# Altium project RK3399-core.PrjPcb
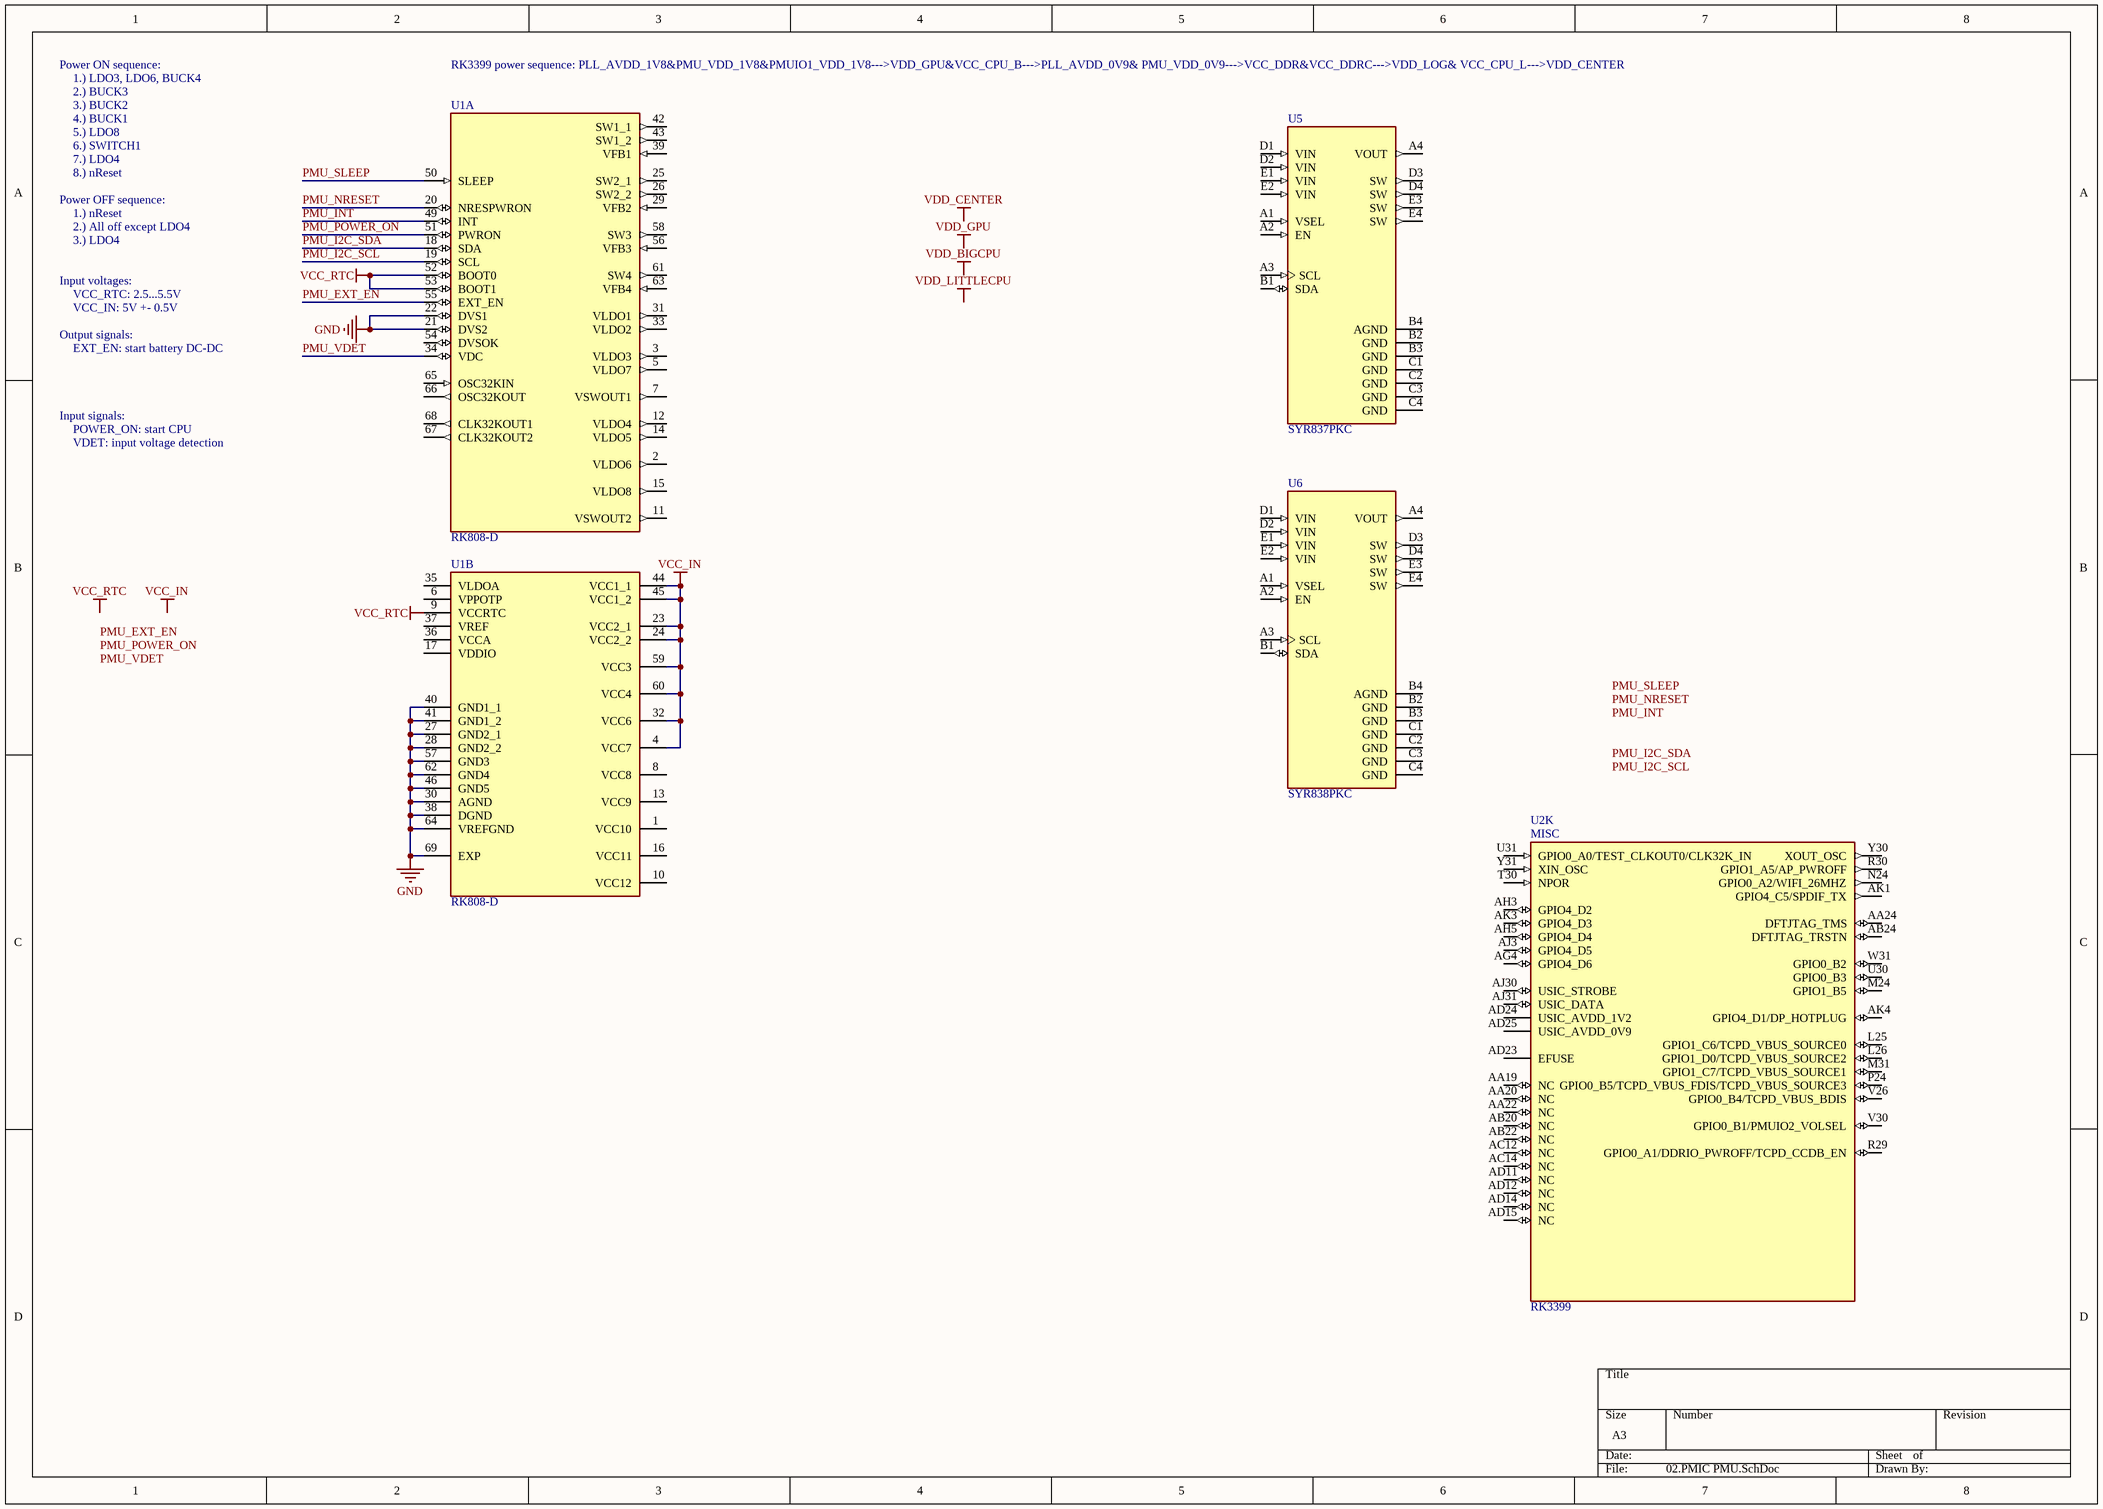
[diagram p0: 02.PMIC PMU.SchDoc]
10 sheets, 6 parts. Net scope: global (net labels, ports and power ports of the same name join across sheets).
Board file: RK3399-core.PcbDoc
Sheets:
  01.Notes.SchDoc
  02.PMIC PMU.SchDoc
  03.RK3399 Power.SchDoc
  04.RK3399 DDR Controller.SchDoc
  05.RK3399 Storage.SchDoc
  06.RK3399 USB.SchDoc
  07.RK3399 Display.SchDoc
  08.RK3399 High speed.SchDoc
  09.RK3399 Misc.SchDoc
  10.LPDDR4.SchDoc

## Sheet 01.Notes.SchDoc
size A4; SheetNumber: 1; SheetTotal: 10

## Sheet 02.PMIC PMU.SchDoc
size A3; SheetNumber: 2; SheetTotal: 10

### Parts
U1  RK808-D  [QFN35P700X700X80-69N]  (parts A,B of 2)
U2  RK3399  [BGA828C65P31X31_2100X2100X161N]  (part K of 32)
U5  SYR837PKC  [BGA20N40P5X4_196X156X66N]
U6  SYR838PKC  [BGA20N40P5X4_196X156X66N]

### Nets
GND: U1.21(DVS2) U1.22(DVS1) U1.27(GND2_1) U1.28(GND2_2) U1.30(AGND) U1.38(DGND) U1.40(GND1_1) U1.41(GND1_2) U1.46(GND5) U1.57(GND3) U1.62(GND4) U1.64(VREFGND) U1.69(EXP)
VCC_IN: U1.4(VCC7) U1.23(VCC2_1) U1.24(VCC2_2) U1.32(VCC6) U1.44(VCC1_1) U1.45(VCC1_2) U1.59(VCC3) U1.60(VCC4)
VCC_RTC: U1.9(VCCRTC) U1.52(BOOT0) U1.53(BOOT1)
PMU_EXT_EN: U1.55(EXT_EN)
PMU_I2C_SCL: U1.19(SCL)
PMU_I2C_SDA: U1.18(SDA)
PMU_INT: U1.49(INT)
PMU_NRESET: U1.20(NRESPWRON)
PMU_POWER_ON: U1.51(PWRON)
PMU_SLEEP: U1.50(SLEEP)
PMU_VDET: U1.34(VDC)

Not connected (* = marked no-connect by the designer): U1 1(VCC10) 2(VLDO6) 3(VLDO3) 5(VLDO7) 6(VPPOTP) 7(VSWOUT1) 8(VCC8) 10(VCC12) 11(VSWOUT2) 12(VLDO4) 13(VCC9) 14(VLDO5) 15(VLDO8) 16(VCC11) 17(VDDIO) 25(SW2_1) 26(SW2_2) 29(VFB2) 31(VLDO1) 33(VLDO2) 35(VLDOA) 36(VCCA) 37(VREF) 39(VFB1) 42(SW1_1) 43(SW1_2) 54(DVSOK) 56(VFB3) 58(SW3) 61(SW4) 63(VFB4) 65(OSC32KIN) 66(OSC32KOUT) 67(CLK32KOUT2) 68(CLK32KOUT1); U2 AA19(NC) AA20(NC) AA22(NC) AA24(DFTJTAG_TMS) AB20(NC) AB22(NC) AB24(DFTJTAG_TRSTN) AC12(NC) AC14(NC) AD11(NC) AD12(NC) AD14(NC) AD15(NC) AD23(EFUSE) AD24(USIC_AVDD_1V2) AD25(USIC_AVDD_0V9) AG4(GPIO4_D6) AH3(GPIO4_D2) AH5(GPIO4_D4) AJ3(GPIO4_D5) AJ30(USIC_STROBE) AJ31(USIC_DATA) AK1(GPIO4_C5/SPDIF_TX) AK3(GPIO4_D3) AK4(GPIO4_D1/DP_HOTPLUG) L25(GPIO1_C6/TCPD_VBUS_SOURCE0) L26(GPIO1_D0/TCPD_VBUS_SOURCE2) M24(GPIO1_B5) M31(GPIO1_C7/TCPD_VBUS_SOURCE1) N24(GPIO0_A2/WIFI_26MHZ) P24(GPIO0_B5/TCPD_VBUS_FDIS/TCPD_VBUS_SOURCE3) R29(GPIO0_A1/DDRIO_PWROFF/TCPD_CCDB_EN) R30(GPIO1_A5/AP_PWROFF) T30(NPOR) U30(GPIO0_B3) U31(GPIO0_A0/TEST_CLKOUT0/CLK32K_IN) V26(GPIO0_B4/TCPD_VBUS_BDIS) V30(GPIO0_B1/PMUIO2_VOLSEL) W31(GPIO0_B2) Y30(XOUT_OSC) Y31(XIN_OSC); U5 A1(VSEL) A2(EN) A3(SCL) A4(VOUT) B1(SDA) B2(GND) B3(GND) B4(AGND) C1(GND) C2(GND) C3(GND) C4(GND) D1(VIN) D2(VIN) D3(SW) D4(SW) E1(VIN) E2(VIN) E3(SW) E4(SW); U6 A1(VSEL) A2(EN) A3(SCL) A4(VOUT) B1(SDA) B2(GND) B3(GND) B4(AGND) C1(GND) C2(GND) C3(GND) C4(GND) D1(VIN) D2(VIN) D3(SW) D4(SW) E1(VIN) E2(VIN) E3(SW) E4(SW)

### Notes on the sheet
- Power ON sequence:
- 1.) LDO3, LDO6, BUCK4
- 2.) BUCK3
- 3.) BUCK2
- RK3399 power sequence: PLL_AVDD_1V8&PMU_VDD_1V8&PMUIO1_VDD_1V8--->VDD_GPU&VCC_CPU_B--->PLL_AVDD_0V9& PMU_VDD_0V9--->VCC_DDR&VCC_DDRC--->VDD_LOG& VCC_CPU_L--->VDD_CENTER
- 4.) BUCK1
- 5.) LDO8
- 6.) SWITCH1
- 7.) LDO4
- 8.) nReset
- Power OFF sequence:
- 1.) nReset
- 2.) All off except LDO4
- 3.) LDO4
- Input voltages:
- VCC_RTC: 2.5...5.5V
- VCC_IN: 5V +- 0.5V
- Output signals:
- EXT_EN: start battery DC-DC
- Input signals:
- POWER_ON: start CPU
- VDET: input voltage detection
- Labels drawn without touching a wire or pin: PMU_EXT_EN, PMU_I2C_SCL, PMU_I2C_SDA, PMU_INT, PMU_NRESET, PMU_POWER_ON, PMU_SLEEP, PMU_VDET, VCC_IN, VCC_RTC, VDD_BIGCPU, VDD_CENTER, VDD_GPU, VDD_LITTLECPU
- (in symbol RK3399, part K) MISC

### Library data of the parts
U1 = RK808-D: Power Management System; MF: Fuzhou Rockchip Electronics Co; Value: *; SnapEDA_Link: https://www.snapeda.com/parts/RK808-D/Fuzhou%20Rockchip%20Electronics%20Co/view-part/1600581/?ref=snap; Price: None; Availability: Unavailable; Package: None; MP: RK808-D
U2 = RK3399: RK3399 ROCK Pi 4 Model A 2GB - ARMÂ® CortexÂ®-A53, CortexÂ®-A72 MPU Embedded Evaluation Board; MF: Rockchip; SnapEDA_Link: https://www.snapeda.com/parts/RK3399/Fuzhou+Rockchip+Electronics+Co/view-part/?ref=snap; Package: Seeed Technology; MP: RK3399; Check_prices: https://www.snapeda.com/parts/RK3399/Fuzhou+Rockchip+Electronics+Co/view-part/?ref=eda; Price: None; Value: *; Availability: Not in stock
U5 U6 = SYR837PKC: SYR837/SYR838 is a high efficiency 2.4MHz synchronous step down DC/DC regulator IC capable of delivering up to 6A output currents.; MF: Silergy; SnapEDA_Link: https://www.snapeda.com/parts/SYR837PKC/Silergy/view-part/2756982/?ref=snap; Value: *; MP: SYR837PKC; Package: None; Price: None; Availability: Unavailable

## Sheet 03.RK3399 Power.SchDoc
size A3; SheetNumber: 3; SheetTotal: 10
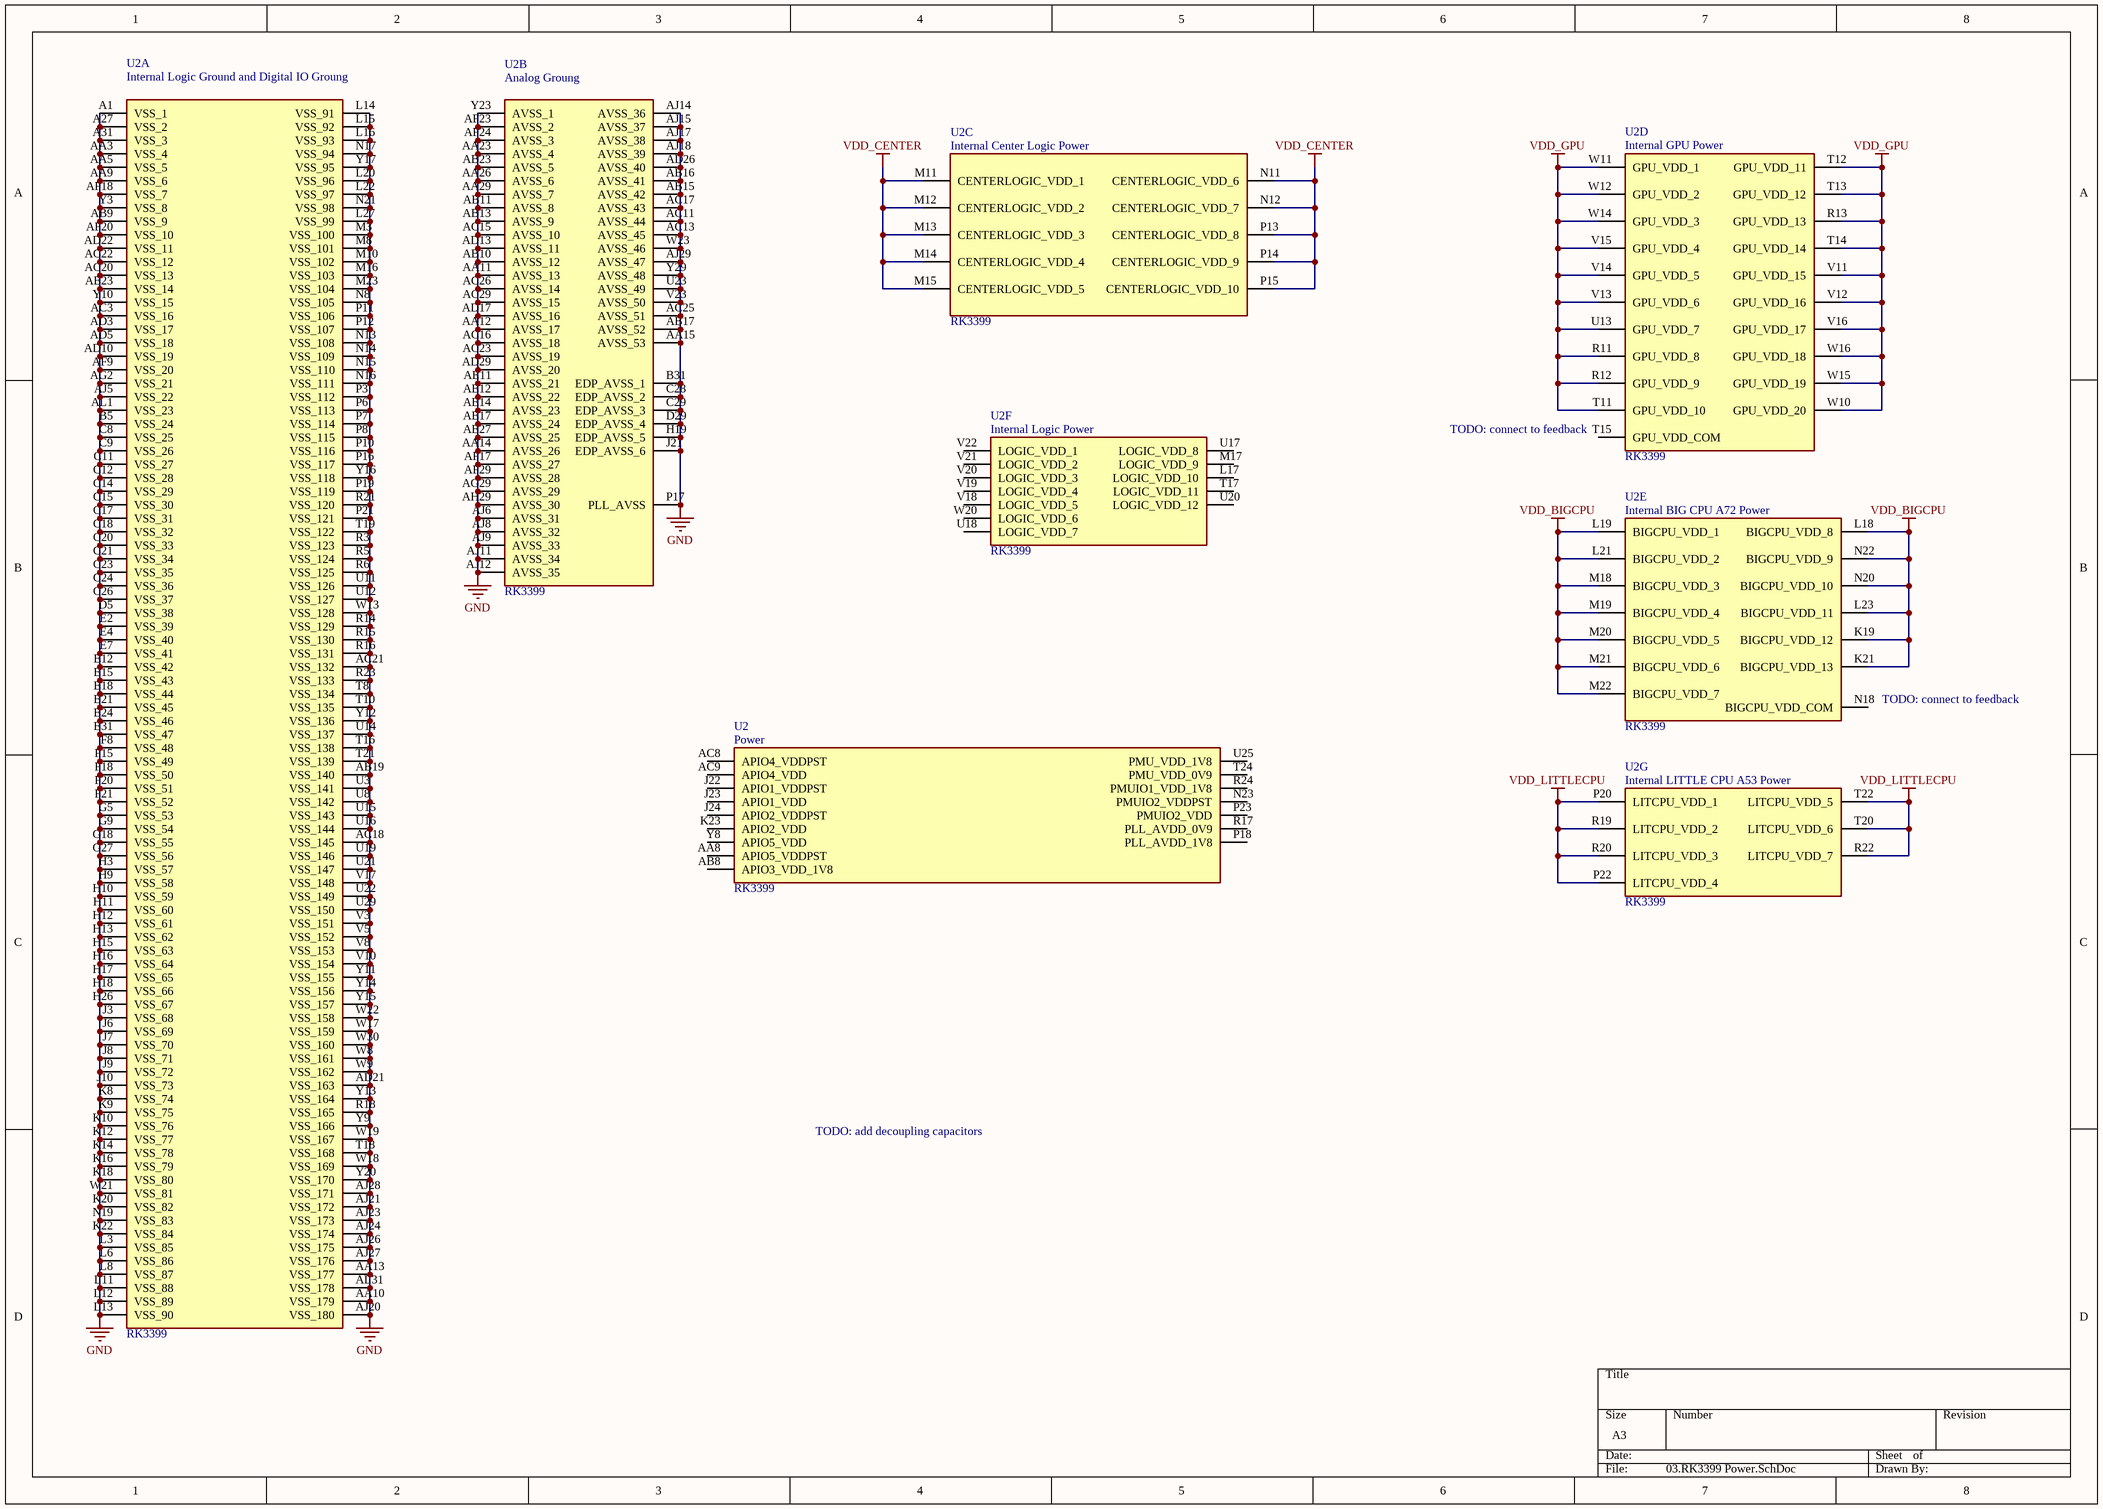
[diagram p1: 03.RK3399 Power.SchDoc]

### Parts
U2  RK3399  [BGA828C65P31X31_2100X2100X161N]  (parts A,B,C,D,E,F,G,29 of 32)

### Nets
GND: U2.A1(VSS_1) U2.A27(VSS_2) U2.A31(VSS_3) U2.AA3(VSS_4) U2.AA5(VSS_5) U2.AA9(VSS_6) U2.AA10(VSS_179) U2.AA11(AVSS_13) U2.AA12(AVSS_17) U2.AA13(VSS_177) U2.AA14(AVSS_26) U2.AA15(AVSS_53) U2.AA23(AVSS_4) U2.AA26(AVSS_6) U2.AA29(AVSS_7) U2.AB9(VSS_9) U2.AB10(AVSS_12) U2.AB11(AVSS_8) U2.AB13(AVSS_9) U2.AB15(AVSS_42) U2.AB16(AVSS_41) U2.AB17(AVSS_52) U2.AB19(VSS_140) U2.AB23(AVSS_5) U2.AC3(VSS_16) U2.AC11(AVSS_44) U2.AC13(AVSS_45) U2.AC15(AVSS_10) U2.AC16(AVSS_18) U2.AC17(AVSS_43) U2.AC18(VSS_145) U2.AC20(VSS_13) U2.AC21(VSS_132) U2.AC22(VSS_12) U2.AC23(AVSS_19) U2.AC25(AVSS_51) U2.AC26(AVSS_14) U2.AC29(AVSS_15) U2.AD3(VSS_17) U2.AD5(VSS_18) U2.AD10(VSS_19) U2.AD13(AVSS_11) U2.AD17(AVSS_16) U2.AD21(VSS_163) U2.AD22(VSS_11) U2.AD26(AVSS_40) U2.AD29(AVSS_20) U2.AE11(AVSS_21) U2.AE12(AVSS_22) U2.AE14(AVSS_23) U2.AE17(AVSS_24) U2.AE23(VSS_14) U2.AE27(AVSS_25) U2.AF9(VSS_20) U2.AF17(AVSS_27) U2.AF18(VSS_7) U2.AF20(VSS_10) U2.AF23(AVSS_2) U2.AF24(AVSS_3) U2.AF29(AVSS_28) U2.AG2(VSS_21) U2.AG29(AVSS_29) U2.AH29(AVSS_30) U2.AJ5(VSS_22) U2.AJ6(AVSS_31) U2.AJ8(AVSS_32) U2.AJ9(AVSS_33) U2.AJ11(AVSS_34) U2.AJ12(AVSS_35) U2.AJ14(AVSS_36) U2.AJ15(AVSS_37) U2.AJ17(AVSS_38) U2.AJ18(AVSS_39) U2.AJ20(VSS_180) U2.AJ21(VSS_172) U2.AJ23(VSS_173) U2.AJ24(VSS_174) U2.AJ26(VSS_175) U2.AJ27(VSS_176) U2.AJ28(VSS_171) U2.AJ29(AVSS_47) U2.AL1(VSS_23) U2.AL31(VSS_178) U2.B5(VSS_24) U2.B31(EDP_AVSS_1) U2.C8(VSS_25) U2.C9(VSS_26) U2.C11(VSS_27) U2.C12(VSS_28) U2.C14(VSS_29) U2.C15(VSS_30) U2.C17(VSS_31) U2.C18(VSS_32) U2.C20(VSS_33) U2.C21(VSS_34) U2.C23(VSS_35) U2.C24(VSS_36) U2.C26(VSS_37) U2.C28(EDP_AVSS_2) U2.C29(EDP_AVSS_3) U2.D5(VSS_38) U2.D29(EDP_AVSS_4) U2.E2(VSS_39) U2.E4(VSS_40) U2.E7(VSS_41) U2.E12(VSS_42) U2.E15(VSS_43) U2.E18(VSS_44) U2.E21(VSS_45) U2.E24(VSS_46) U2.E31(VSS_47) U2.F8(VSS_48) U2.F15(VSS_49) U2.F18(VSS_50) U2.F20(VSS_51) U2.F21(VSS_52) U2.G5(VSS_53) U2.G9(VSS_54) U2.G18(VSS_55) U2.G27(VSS_56) U2.H3(VSS_57) U2.H9(VSS_58) U2.H10(VSS_59) U2.H11(VSS_60) U2.H12(VSS_61) U2.H13(VSS_62) U2.H15(VSS_63) U2.H16(VSS_64) U2.H17(VSS_65) U2.H18(VSS_66) U2.H19(EDP_AVSS_5) U2.H26(VSS_67) U2.J3(VSS_68) U2.J6(VSS_69) U2.J7(VSS_70) U2.J8(VSS_71) U2.J9(VSS_72) U2.J10(VSS_73) U2.J21(EDP_AVSS_6) U2.K8(VSS_74) U2.K9(VSS_75) U2.K10(VSS_76) U2.K12(VSS_77) U2.K14(VSS_78) U2.K16(VSS_79) U2.K18(VSS_80) U2.K20(VSS_82) U2.K22(VSS_84) U2.L3(VSS_85) U2.L6(VSS_86) U2.L8(VSS_87) U2.L11(VSS_88) U2.L12(VSS_89) U2.L13(VSS_90) U2.L14(VSS_91) U2.L15(VSS_92) U2.L16(VSS_93) U2.L20(VSS_96) U2.L22(VSS_97) U2.L27(VSS_99) U2.M3(VSS_100) U2.M8(VSS_101) U2.M10(VSS_102) U2.M16(VSS_103) U2.M23(VSS_104) U2.N8(VSS_105) U2.N13(VSS_108) U2.N14(VSS_109) U2.N15(VSS_110) U2.N16(VSS_111) U2.N17(VSS_94) U2.N19(VSS_83) U2.N21(VSS_98) U2.P3(VSS_112) U2.P6(VSS_113) U2.P7(VSS_114) U2.P8(VSS_115) U2.P10(VSS_116) U2.P11(VSS_106) U2.P12(VSS_107) U2.P16(VSS_117) U2.P17(PLL_AVSS) U2.P19(VSS_119) U2.P21(VSS_121) U2.R3(VSS_123) U2.R5(VSS_124) U2.R6(VSS_125) U2.R14(VSS_129) U2.R15(VSS_130) U2.R16(VSS_131) U2.R18(VSS_165) U2.R21(VSS_120) U2.R23(VSS_133) U2.T8(VSS_134) U2.T10(VSS_135) U2.T16(VSS_138) U2.T18(VSS_168) U2.T19(VSS_122) U2.T21(VSS_139) U2.U3(VSS_141) U2.U8(VSS_142) U2.U11(VSS_126) U2.U12(VSS_127) U2.U14(VSS_137) U2.U15(VSS_143) U2.U16(VSS_144) U2.U19(VSS_146) U2.U21(VSS_147) U2.U22(VSS_149) U2.U23(AVSS_49) U2.U29(VSS_150) U2.V3(VSS_151) U2.V5(VSS_152) U2.V8(VSS_153) U2.V10(VSS_154) U2.V17(VSS_148) U2.V23(AVSS_50) U2.W8(VSS_161) U2.W9(VSS_162) U2.W13(VSS_128) U2.W17(VSS_159) U2.W18(VSS_169) U2.W19(VSS_167) U2.W21(VSS_81) U2.W22(VSS_158) U2.W23(AVSS_46) U2.W30(VSS_160) U2.Y3(VSS_8) U2.Y9(VSS_166) U2.Y10(VSS_15) U2.Y11(VSS_155) U2.Y12(VSS_136) U2.Y13(VSS_164) U2.Y14(VSS_156) U2.Y15(VSS_157) U2.Y16(VSS_118) U2.Y17(VSS_95) U2.Y20(VSS_170) U2.Y23(AVSS_1) U2.Y29(AVSS_48)
VDD_BIGCPU: U2.K19(BIGCPU_VDD_12) U2.K21(BIGCPU_VDD_13) U2.L18(BIGCPU_VDD_8) U2.L19(BIGCPU_VDD_1) U2.L21(BIGCPU_VDD_2) U2.L23(BIGCPU_VDD_11) U2.M18(BIGCPU_VDD_3) U2.M19(BIGCPU_VDD_4) U2.M20(BIGCPU_VDD_5) U2.M21(BIGCPU_VDD_6) U2.M22(BIGCPU_VDD_7) U2.N20(BIGCPU_VDD_10) U2.N22(BIGCPU_VDD_9)
VDD_CENTER: U2.M11(CENTERLOGIC_VDD_1) U2.M12(CENTERLOGIC_VDD_2) U2.M13(CENTERLOGIC_VDD_3) U2.M14(CENTERLOGIC_VDD_4) U2.M15(CENTERLOGIC_VDD_5) U2.N11(CENTERLOGIC_VDD_6) U2.N12(CENTERLOGIC_VDD_7) U2.P13(CENTERLOGIC_VDD_8) U2.P14(CENTERLOGIC_VDD_9) U2.P15(CENTERLOGIC_VDD_10)
VDD_GPU: U2.R11(GPU_VDD_8) U2.R12(GPU_VDD_9) U2.R13(GPU_VDD_13) U2.T11(GPU_VDD_10) U2.T12(GPU_VDD_11) U2.T13(GPU_VDD_12) U2.T14(GPU_VDD_14) U2.U13(GPU_VDD_7) U2.V11(GPU_VDD_15) U2.V12(GPU_VDD_16) U2.V13(GPU_VDD_6) U2.V14(GPU_VDD_5) U2.V15(GPU_VDD_4) U2.V16(GPU_VDD_17) U2.W10(GPU_VDD_20) U2.W11(GPU_VDD_1) U2.W12(GPU_VDD_2) U2.W14(GPU_VDD_3) U2.W15(GPU_VDD_19) U2.W16(GPU_VDD_18)
VDD_LITTLECPU: U2.P20(LITCPU_VDD_1) U2.P22(LITCPU_VDD_4) U2.R19(LITCPU_VDD_2) U2.R20(LITCPU_VDD_3) U2.R22(LITCPU_VDD_7) U2.T20(LITCPU_VDD_6) U2.T22(LITCPU_VDD_5)

Not connected (* = marked no-connect by the designer): U2 AA8(APIO5_VDDPST) AB8(APIO3_VDD_1V8) AC8(APIO4_VDDPST) AC9(APIO4_VDD) J22(APIO1_VDDPST) J23(APIO1_VDD) J24(APIO2_VDDPST) K23(APIO2_VDD) L17(LOGIC_VDD_10) M17(LOGIC_VDD_9) N18(BIGCPU_VDD_COM) N23(PMUIO2_VDDPST) P18(PLL_AVDD_1V8) P23(PMUIO2_VDD) R17(PLL_AVDD_0V9) R24(PMUIO1_VDD_1V8) T15(GPU_VDD_COM) T17(LOGIC_VDD_11) T24(PMU_VDD_0V9) U17(LOGIC_VDD_8) U18(LOGIC_VDD_7) U20(LOGIC_VDD_12) U25(PMU_VDD_1V8) V18(LOGIC_VDD_5) V19(LOGIC_VDD_4) V20(LOGIC_VDD_3) V21(LOGIC_VDD_2) V22(LOGIC_VDD_1) W20(LOGIC_VDD_6) Y8(APIO5_VDD)

### Notes on the sheet
- (near U2) TODO: connect to feedback
- TODO: add decoupling capacitors
- (in symbol RK3399, part A) Internal Logic Ground and Digital IO Groung
- (in symbol RK3399, part B) Analog Groung
- (in symbol RK3399, part C) Internal Center Logic Power
- (in symbol RK3399, part D) Internal GPU Power
- (in symbol RK3399, part E) Internal BIG CPU A72 Power
- (in symbol RK3399, part F) Internal Logic Power
- (in symbol RK3399, part G) Internal LITTLE CPU A53 Power
- (in symbol RK3399, part 29) Power

### Library data of the parts
U2 = RK3399: as U2 on sheet 02.PMIC PMU; SnapEDA_Link: https://www.snapeda.com/parts/RK3399/Fuzhou+Rockchip+Electronics+Co/view-part/?ref=snap; Package: Seeed Technology; MP: RK3399; Check_prices: https://www.snapeda.com/parts/RK3399/Fuzhou+Rockchip+Electronics+Co/view-part/?ref=eda; Price: None; Value: *; Availability: Not in stock

## Sheet 04.RK3399 DDR Controller.SchDoc
size A4; SheetNumber: 4; SheetTotal: 10
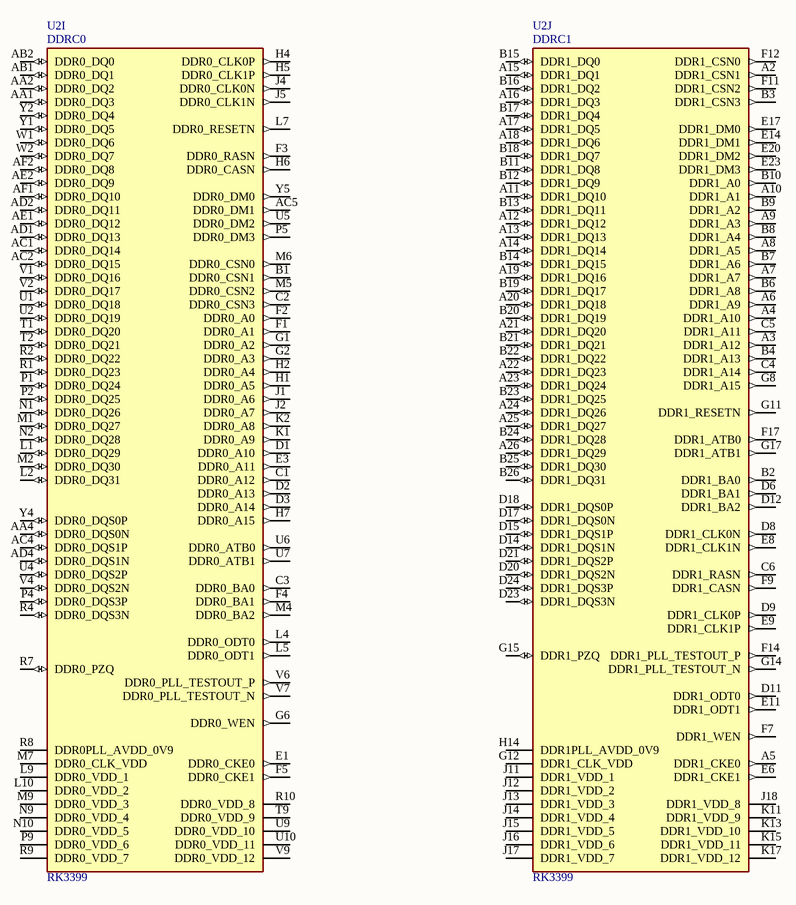
[diagram p2: 04.RK3399 DDR Controller.SchDoc]

### Parts
U2  RK3399  [BGA828C65P31X31_2100X2100X161N]  (parts I,J of 32)

### Nets

Not connected (* = marked no-connect by the designer): U2 A2(DDR1_CSN1) A3(DDR1_A12) A4(DDR1_A10) A5(DDR1_CKE0) A6(DDR1_A9) A7(DDR1_A7) A8(DDR1_A5) A9(DDR1_A3) A10(DDR1_A1) A11(DDR1_DQ10) A12(DDR1_DQ12) A13(DDR1_DQ13) A14(DDR1_DQ14) A15(DDR1_DQ1) A16(DDR1_DQ3) A17(DDR1_DQ5) A18(DDR1_DQ6) A19(DDR1_DQ16) A20(DDR1_DQ18) A21(DDR1_DQ20) A22(DDR1_DQ23) A23(DDR1_DQ24) A24(DDR1_DQ26) A25(DDR1_DQ27) A26(DDR1_DQ29) AA1(DDR0_DQ3) AA2(DDR0_DQ2) AA4(DDR0_DQS0N) AB1(DDR0_DQ1) AB2(DDR0_DQ0) AC1(DDR0_DQ14) AC2(DDR0_DQ15) AC4(DDR0_DQS1P) AC5(DDR0_DM1) AD1(DDR0_DQ13) AD2(DDR0_DQ11) AD4(DDR0_DQS1N) AE1(DDR0_DQ12) AE2(DDR0_DQ9) AF1(DDR0_DQ10) AF2(DDR0_DQ8) B1(DDR0_CSN1) B2(DDR1_BA0) B3(DDR1_CSN3) B4(DDR1_A13) B6(DDR1_A8) B7(DDR1_A6) B8(DDR1_A4) B9(DDR1_A2) B10(DDR1_A0) B11(DDR1_DQ8) B12(DDR1_DQ9) B13(DDR1_DQ11) B14(DDR1_DQ15) B15(DDR1_DQ0) B16(DDR1_DQ2) B17(DDR1_DQ4) B18(DDR1_DQ7) B19(DDR1_DQ17) B20(DDR1_DQ19) B21(DDR1_DQ21) B22(DDR1_DQ22) B23(DDR1_DQ25) B24(DDR1_DQ28) B25(DDR1_DQ30) B26(DDR1_DQ31) C1(DDR0_A12) C2(DDR0_CSN3) C3(DDR0_BA0) C4(DDR1_A14) C5(DDR1_A11) C6(DDR1_RASN) D1(DDR0_A10) D2(DDR0_A13) D3(DDR0_A14) D6(DDR1_BA1) D8(DDR1_CLK0N) D9(DDR1_CLK0P) D11(DDR1_ODT0) D12(DDR1_BA2) D14(DDR1_DQS1N) D15(DDR1_DQS1P) D17(DDR1_DQS0N) D18(DDR1_DQS0P) D20(DDR1_DQS2N) D21(DDR1_DQS2P) D23(DDR1_DQS3N) D24(DDR1_DQS3P) E1(DDR0_CKE0) E3(DDR0_A11) E6(DDR1_CKE1) E8(DDR1_CLK1N) E9(DDR1_CLK1P) E11(DDR1_ODT1) E14(DDR1_DM1) E17(DDR1_DM0) E20(DDR1_DM2) E23(DDR1_DM3) F1(DDR0_A1) F2(DDR0_A0) F3(DDR0_RASN) F4(DDR0_BA1) F5(DDR0_CKE1) F7(DDR1_WEN) F9(DDR1_CASN) F11(DDR1_CSN2) F12(DDR1_CSN0) F14(DDR1_PLL_TESTOUT_P) F17(DDR1_ATB0) G1(DDR0_A2) G2(DDR0_A3) G6(DDR0_WEN) G8(DDR1_A15) G11(DDR1_RESETN) G12(DDR1_CLK_VDD) G14(DDR1_PLL_TESTOUT_N) G15(DDR1_PZQ) G17(DDR1_ATB1) H1(DDR0_A5) H2(DDR0_A4) H4(DDR0_CLK0P) H5(DDR0_CLK1P) H6(DDR0_CASN) H7(DDR0_A15) H14(DDR1PLL_AVDD_0V9) J1(DDR0_A6) J2(DDR0_A7) J4(DDR0_CLK0N) J5(DDR0_CLK1N) J11(DDR1_VDD_1) J12(DDR1_VDD_2) J13(DDR1_VDD_3) J14(DDR1_VDD_4) J15(DDR1_VDD_5) J16(DDR1_VDD_6) J17(DDR1_VDD_7) J18(DDR1_VDD_8) K1(DDR0_A9) K2(DDR0_A8) K11(DDR1_VDD_9) K13(DDR1_VDD_10) K15(DDR1_VDD_11) K17(DDR1_VDD_12) L1(DDR0_DQ29) L2(DDR0_DQ31) L4(DDR0_ODT0) L5(DDR0_ODT1) L7(DDR0_RESETN) L9(DDR0_VDD_1) L10(DDR0_VDD_2) M1(DDR0_DQ27) M2(DDR0_DQ30) M4(DDR0_BA2) M5(DDR0_CSN2) M6(DDR0_CSN0) M7(DDR0_CLK_VDD) M9(DDR0_VDD_3) N1(DDR0_DQ26) N2(DDR0_DQ28) N9(DDR0_VDD_4) N10(DDR0_VDD_5) P1(DDR0_DQ24) P2(DDR0_DQ25) P4(DDR0_DQS3P) P5(DDR0_DM3) P9(DDR0_VDD_6) R1(DDR0_DQ23) R2(DDR0_DQ22) R4(DDR0_DQS3N) R7(DDR0_PZQ) R8(DDR0PLL_AVDD_0V9) R9(DDR0_VDD_7) R10(DDR0_VDD_8) T1(DDR0_DQ20) T2(DDR0_DQ21) T9(DDR0_VDD_9) U1(DDR0_DQ18) U2(DDR0_DQ19) U4(DDR0_DQS2P) U5(DDR0_DM2) U6(DDR0_ATB0) U7(DDR0_ATB1) U9(DDR0_VDD_10) U10(DDR0_VDD_11) V1(DDR0_DQ16) V2(DDR0_DQ17) V4(DDR0_DQS2N) V6(DDR0_PLL_TESTOUT_P) V7(DDR0_PLL_TESTOUT_N) V9(DDR0_VDD_12) W1(DDR0_DQ6) W2(DDR0_DQ7) Y1(DDR0_DQ5) Y2(DDR0_DQ4) Y4(DDR0_DQS0P) Y5(DDR0_DM0)

### Notes on the sheet
- (in symbol RK3399, part I) DDRC0
- (in symbol RK3399, part J) DDRC1

### Library data of the parts
U2 = RK3399: as U2 on sheet 02.PMIC PMU; SnapEDA_Link: https://www.snapeda.com/parts/RK3399/Fuzhou+Rockchip+Electronics+Co/view-part/?ref=snap; Package: Seeed Technology; MP: RK3399; Check_prices: https://www.snapeda.com/parts/RK3399/Fuzhou+Rockchip+Electronics+Co/view-part/?ref=eda; Price: None; Value: *; Availability: Not in stock

## Sheet 05.RK3399 Storage.SchDoc
size A4; SheetNumber: 5; SheetTotal: 10
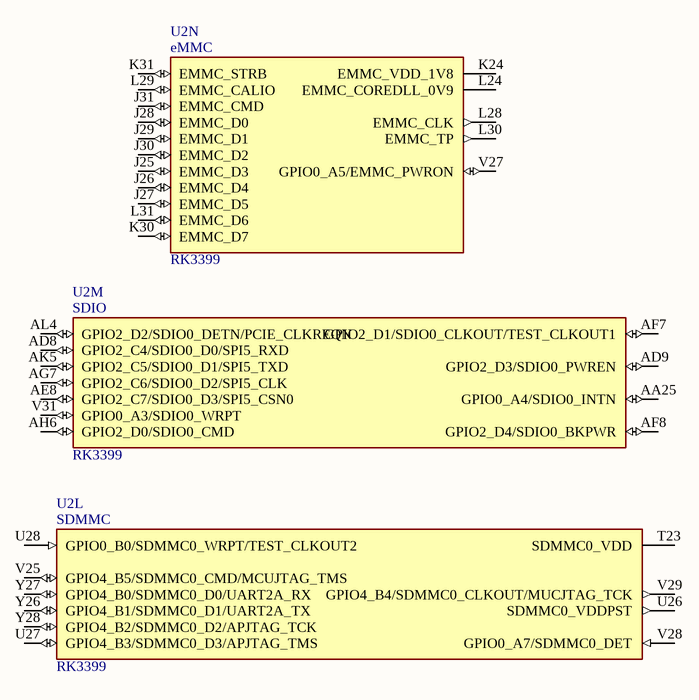
[diagram p3: 05.RK3399 Storage.SchDoc]

### Parts
U2  RK3399  [BGA828C65P31X31_2100X2100X161N]  (parts L,M,N of 32)

### Nets

Not connected (* = marked no-connect by the designer): U2 AA25(GPIO0_A4/SDIO0_INTN) AD8(GPIO2_C4/SDIO0_D0/SPI5_RXD) AD9(GPIO2_D3/SDIO0_PWREN) AE8(GPIO2_C7/SDIO0_D3/SPI5_CSN0) AF7(GPIO2_D1/SDIO0_CLKOUT/TEST_CLKOUT1) AF8(GPIO2_D4/SDIO0_BKPWR) AG7(GPIO2_C6/SDIO0_D2/SPI5_CLK) AH6(GPIO2_D0/SDIO0_CMD) AK5(GPIO2_C5/SDIO0_D1/SPI5_TXD) AL4(GPIO2_D2/SDIO0_DETN/PCIE_CLKREQN) J25(EMMC_D3) J26(EMMC_D4) J27(EMMC_D5) J28(EMMC_D0) J29(EMMC_D1) J30(EMMC_D2) J31(EMMC_CMD) K24(EMMC_VDD_1V8) K30(EMMC_D7) K31(EMMC_STRB) L24(EMMC_COREDLL_0V9) L28(EMMC_CLK) L29(EMMC_CALIO) L30(EMMC_TP) L31(EMMC_D6) T23(SDMMC0_VDD) U26(SDMMC0_VDDPST) U27(GPIO4_B3/SDMMC0_D3/APJTAG_TMS) U28(GPIO0_B0/SDMMC0_WRPT/TEST_CLKOUT2) V25(GPIO4_B5/SDMMC0_CMD/MCUJTAG_TMS) V27(GPIO0_A5/EMMC_PWRON) V28(GPIO0_A7/SDMMC0_DET) V29(GPIO4_B4/SDMMC0_CLKOUT/MUCJTAG_TCK) V31(GPIO0_A3/SDIO0_WRPT) Y26(GPIO4_B1/SDMMC0_D1/UART2A_TX) Y27(GPIO4_B0/SDMMC0_D0/UART2A_RX) Y28(GPIO4_B2/SDMMC0_D2/APJTAG_TCK)

### Notes on the sheet
- (in symbol RK3399, part L) SDMMC
- (in symbol RK3399, part M) SDIO
- (in symbol RK3399, part N) eMMC

### Library data of the parts
U2 = RK3399: as U2 on sheet 02.PMIC PMU; SnapEDA_Link: https://www.snapeda.com/parts/RK3399/Fuzhou+Rockchip+Electronics+Co/view-part/?ref=snap; Package: Seeed Technology; MP: RK3399; Check_prices: https://www.snapeda.com/parts/RK3399/Fuzhou+Rockchip+Electronics+Co/view-part/?ref=eda; Price: None; Value: *; Availability: Not in stock

## Sheet 06.RK3399 USB.SchDoc
size A4; SheetNumber: 6; SheetTotal: 10
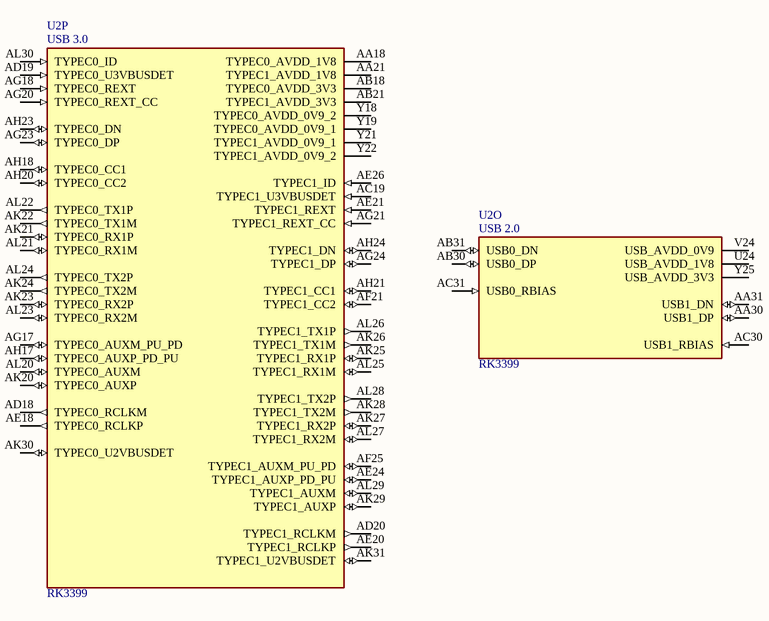
[diagram p4: 06.RK3399 USB.SchDoc]

### Parts
U2  RK3399  [BGA828C65P31X31_2100X2100X161N]  (parts O,P of 32)

### Nets

Not connected (* = marked no-connect by the designer): U2 AA18(TYPEC0_AVDD_1V8) AA21(TYPEC1_AVDD_1V8) AA30(USB1_DP) AA31(USB1_DN) AB18(TYPEC0_AVDD_3V3) AB21(TYPEC1_AVDD_3V3) AB30(USB0_DP) AB31(USB0_DN) AC19(TYPEC1_U3VBUSDET) AC30(USB1_RBIAS) AC31(USB0_RBIAS) AD18(TYPEC0_RCLKM) AD19(TYPEC0_U3VBUSDET) AD20(TYPEC1_RCLKM) AE18(TYPEC0_RCLKP) AE20(TYPEC1_RCLKP) AE21(TYPEC1_REXT) AE24(TYPEC1_AUXP_PD_PU) AE26(TYPEC1_ID) AF21(TYPEC1_CC2) AF25(TYPEC1_AUXM_PU_PD) AG17(TYPEC0_AUXM_PU_PD) AG18(TYPEC0_REXT) AG20(TYPEC0_REXT_CC) AG21(TYPEC1_REXT_CC) AG23(TYPEC0_DP) AG24(TYPEC1_DP) AH17(TYPEC0_AUXP_PD_PU) AH18(TYPEC0_CC1) AH20(TYPEC0_CC2) AH21(TYPEC1_CC1) AH23(TYPEC0_DN) AH24(TYPEC1_DN) AK20(TYPEC0_AUXP) AK21(TYPEC0_RX1P) AK22(TYPEC0_TX1M) AK23(TYPEC0_RX2P) AK24(TYPEC0_TX2M) AK25(TYPEC1_RX1P) AK26(TYPEC1_TX1M) AK27(TYPEC1_RX2P) AK28(TYPEC1_TX2M) AK29(TYPEC1_AUXP) AK30(TYPEC0_U2VBUSDET) AK31(TYPEC1_U2VBUSDET) AL20(TYPEC0_AUXM) AL21(TYPEC0_RX1M) AL22(TYPEC0_TX1P) AL23(TYPEC0_RX2M) AL24(TYPEC0_TX2P) AL25(TYPEC1_RX1M) AL26(TYPEC1_TX1P) AL27(TYPEC1_RX2M) AL28(TYPEC1_TX2P) AL29(TYPEC1_AUXM) AL30(TYPEC0_ID) U24(USB_AVDD_1V8) V24(USB_AVDD_0V9) Y18(TYPEC0_AVDD_0V9_2) Y19(TYPEC0_AVDD_0V9_1) Y21(TYPEC1_AVDD_0V9_1) Y22(TYPEC1_AVDD_0V9_2) Y25(USB_AVDD_3V3)

### Notes on the sheet
- (in symbol RK3399, part O) USB 2.0
- (in symbol RK3399, part P) USB 3.0

### Library data of the parts
U2 = RK3399: as U2 on sheet 02.PMIC PMU; SnapEDA_Link: https://www.snapeda.com/parts/RK3399/Fuzhou+Rockchip+Electronics+Co/view-part/?ref=snap; Package: Seeed Technology; MP: RK3399; Check_prices: https://www.snapeda.com/parts/RK3399/Fuzhou+Rockchip+Electronics+Co/view-part/?ref=eda; Price: None; Value: *; Availability: Not in stock

## Sheet 07.RK3399 Display.SchDoc
size A4; SheetNumber: 7; SheetTotal: 10
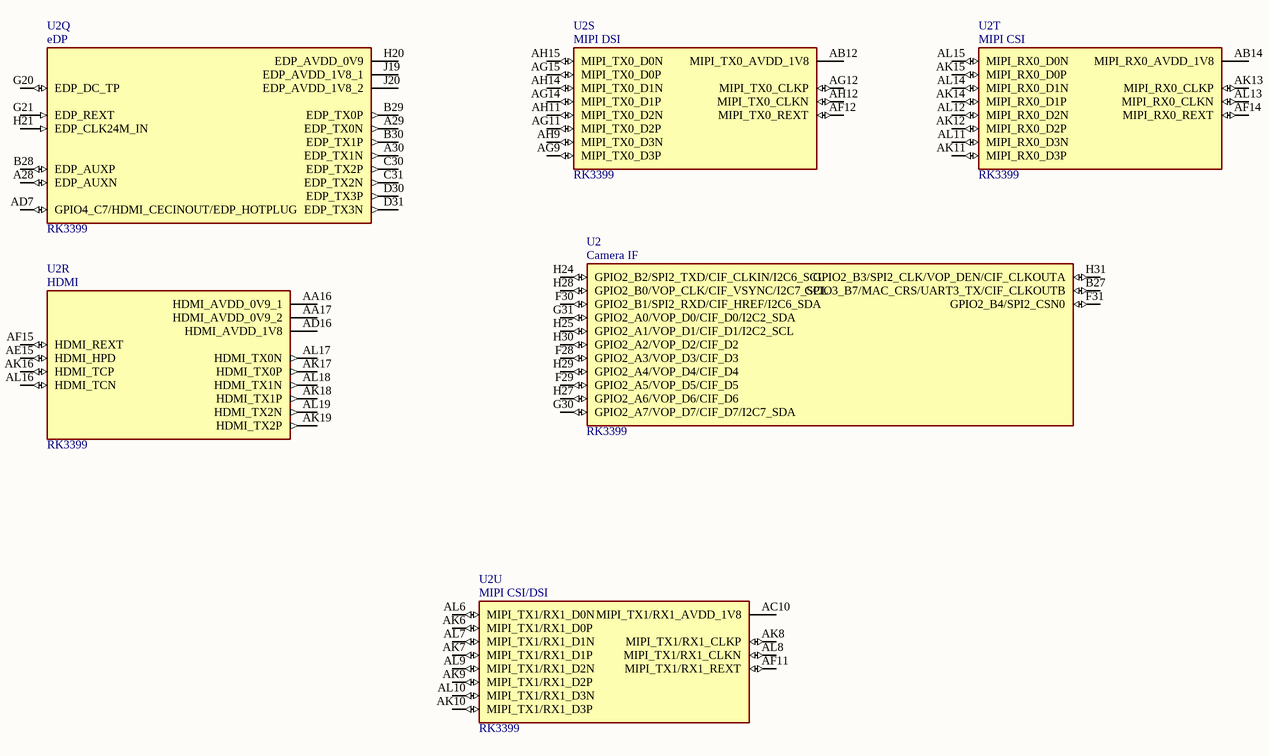
[diagram p5: 07.RK3399 Display.SchDoc]

### Parts
U2  RK3399  [BGA828C65P31X31_2100X2100X161N]  (parts Q,R,S,T,U,28 of 32)

### Nets

Not connected (* = marked no-connect by the designer): U2 A28(EDP_AUXN) A29(EDP_TX0N) A30(EDP_TX1N) AA16(HDMI_AVDD_0V9_1) AA17(HDMI_AVDD_0V9_2) AB12(MIPI_TX0_AVDD_1V8) AB14(MIPI_RX0_AVDD_1V8) AC10(MIPI_TX1/RX1_AVDD_1V8) AD7(GPIO4_C7/HDMI_CECINOUT/EDP_HOTPLUG) AD16(HDMI_AVDD_1V8) AE15(HDMI_HPD) AF11(MIPI_TX1/RX1_REXT) AF12(MIPI_TX0_REXT) AF14(MIPI_RX0_REXT) AF15(HDMI_REXT) AG9(MIPI_TX0_D3P) AG11(MIPI_TX0_D2P) AG12(MIPI_TX0_CLKP) AG14(MIPI_TX0_D1P) AG15(MIPI_TX0_D0P) AH9(MIPI_TX0_D3N) AH11(MIPI_TX0_D2N) AH12(MIPI_TX0_CLKN) AH14(MIPI_TX0_D1N) AH15(MIPI_TX0_D0N) AK6(MIPI_TX1/RX1_D0P) AK7(MIPI_TX1/RX1_D1P) AK8(MIPI_TX1/RX1_CLKP) AK9(MIPI_TX1/RX1_D2P) AK10(MIPI_TX1/RX1_D3P) AK11(MIPI_RX0_D3P) AK12(MIPI_RX0_D2P) AK13(MIPI_RX0_CLKP) AK14(MIPI_RX0_D1P) AK15(MIPI_RX0_D0P) AK16(HDMI_TCP) AK17(HDMI_TX0P) AK18(HDMI_TX1P) AK19(HDMI_TX2P) AL6(MIPI_TX1/RX1_D0N) AL7(MIPI_TX1/RX1_D1N) AL8(MIPI_TX1/RX1_CLKN) AL9(MIPI_TX1/RX1_D2N) AL10(MIPI_TX1/RX1_D3N) AL11(MIPI_RX0_D3N) AL12(MIPI_RX0_D2N) AL13(MIPI_RX0_CLKN) AL14(MIPI_RX0_D1N) AL15(MIPI_RX0_D0N) AL16(HDMI_TCN) AL17(HDMI_TX0N) AL18(HDMI_TX1N) AL19(HDMI_TX2N) B27(GPIO3_B7/MAC_CRS/UART3_TX/CIF_CLKOUTB) B28(EDP_AUXP) B29(EDP_TX0P) B30(EDP_TX1P) C30(EDP_TX2P) C31(EDP_TX2N) D30(EDP_TX3P) D31(EDP_TX3N) F28(GPIO2_A3/VOP_D3/CIF_D3) F29(GPIO2_A5/VOP_D5/CIF_D5) F30(GPIO2_B1/SPI2_RXD/CIF_HREF/I2C6_SDA) F31(GPIO2_B4/SPI2_CSN0) G20(EDP_DC_TP) G21(EDP_REXT) G30(GPIO2_A7/VOP_D7/CIF_D7/I2C7_SDA) G31(GPIO2_A0/VOP_D0/CIF_D0/I2C2_SDA) H20(EDP_AVDD_0V9) H21(EDP_CLK24M_IN) H24(GPIO2_B2/SPI2_TXD/CIF_CLKIN/I2C6_SCL) H25(GPIO2_A1/VOP_D1/CIF_D1/I2C2_SCL) H27(GPIO2_A6/VOP_D6/CIF_D6) H28(GPIO2_B0/VOP_CLK/CIF_VSYNC/I2C7_SCL) H29(GPIO2_A4/VOP_D4/CIF_D4) H30(GPIO2_A2/VOP_D2/CIF_D2) H31(GPIO2_B3/SPI2_CLK/VOP_DEN/CIF_CLKOUTA) J19(EDP_AVDD_1V8_1) J20(EDP_AVDD_1V8_2)

### Notes on the sheet
- (in symbol RK3399, part Q) eDP
- (in symbol RK3399, part R) HDMI
- (in symbol RK3399, part S) MIPI DSI
- (in symbol RK3399, part T) MIPI CSI
- (in symbol RK3399, part U) MIPI CSI/DSI
- (in symbol RK3399, part 28) Camera IF

### Library data of the parts
U2 = RK3399: as U2 on sheet 02.PMIC PMU; SnapEDA_Link: https://www.snapeda.com/parts/RK3399/Fuzhou+Rockchip+Electronics+Co/view-part/?ref=snap; Package: Seeed Technology; MP: RK3399; Check_prices: https://www.snapeda.com/parts/RK3399/Fuzhou+Rockchip+Electronics+Co/view-part/?ref=eda; Price: None; Value: *; Availability: Not in stock

## Sheet 08.RK3399 High speed.SchDoc
size A4; SheetNumber: 8; SheetTotal: 10
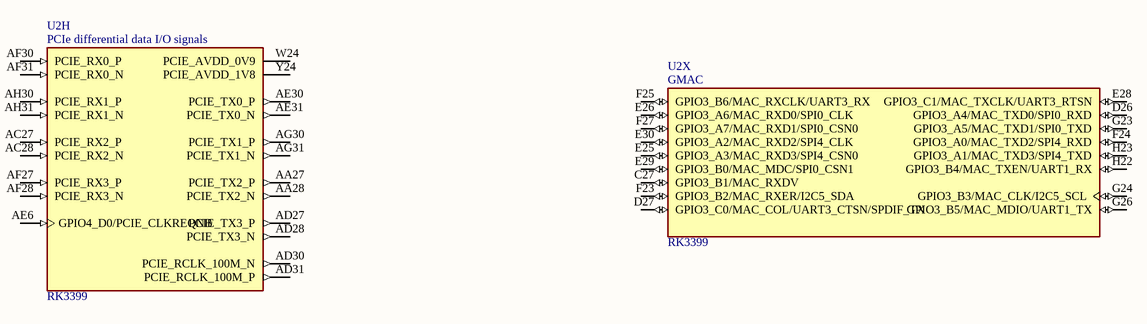
[diagram p6: 08.RK3399 High speed.SchDoc]

### Parts
U2  RK3399  [BGA828C65P31X31_2100X2100X161N]  (parts H,X of 32)

### Nets

Not connected (* = marked no-connect by the designer): U2 AA27(PCIE_TX2_P) AA28(PCIE_TX2_N) AC27(PCIE_RX2_P) AC28(PCIE_RX2_N) AD27(PCIE_TX3_P) AD28(PCIE_TX3_N) AD30(PCIE_RCLK_100M_N) AD31(PCIE_RCLK_100M_P) AE6(GPIO4_D0/PCIE_CLKREQNB) AE30(PCIE_TX0_P) AE31(PCIE_TX0_N) AF27(PCIE_RX3_P) AF28(PCIE_RX3_N) AF30(PCIE_RX0_P) AF31(PCIE_RX0_N) AG30(PCIE_TX1_P) AG31(PCIE_TX1_N) AH30(PCIE_RX1_P) AH31(PCIE_RX1_N) C27(GPIO3_B1/MAC_RXDV) D26(GPIO3_A4/MAC_TXD0/SPI0_RXD) D27(GPIO3_C0/MAC_COL/UART3_CTSN/SPDIF_TX) E25(GPIO3_A3/MAC_RXD3/SPI4_CSN0) E26(GPIO3_A6/MAC_RXD0/SPI0_CLK) E28(GPIO3_C1/MAC_TXCLK/UART3_RTSN) E29(GPIO3_B0/MAC_MDC/SPI0_CSN1) E30(GPIO3_A2/MAC_RXD2/SPI4_CLK) F23(GPIO3_B2/MAC_RXER/I2C5_SDA) F24(GPIO3_A0/MAC_TXD2/SPI4_RXD) F25(GPIO3_B6/MAC_RXCLK/UART3_RX) F27(GPIO3_A7/MAC_RXD1/SPI0_CSN0) G23(GPIO3_A5/MAC_TXD1/SPI0_TXD) G24(GPIO3_B3/MAC_CLK/I2C5_SCL) G26(GPIO3_B5/MAC_MDIO/UART1_TX) H22(GPIO3_B4/MAC_TXEN/UART1_RX) H23(GPIO3_A1/MAC_TXD3/SPI4_TXD) W24(PCIE_AVDD_0V9) Y24(PCIE_AVDD_1V8)

### Notes on the sheet
- (in symbol RK3399, part H) PCIe differential data I/O signals
- (in symbol RK3399, part X) GMAC

### Library data of the parts
U2 = RK3399: as U2 on sheet 02.PMIC PMU; SnapEDA_Link: https://www.snapeda.com/parts/RK3399/Fuzhou+Rockchip+Electronics+Co/view-part/?ref=snap; Package: Seeed Technology; MP: RK3399; Check_prices: https://www.snapeda.com/parts/RK3399/Fuzhou+Rockchip+Electronics+Co/view-part/?ref=eda; Price: None; Value: *; Availability: Not in stock

## Sheet 09.RK3399 Misc.SchDoc
size A4; SheetNumber: 9; SheetTotal: 10
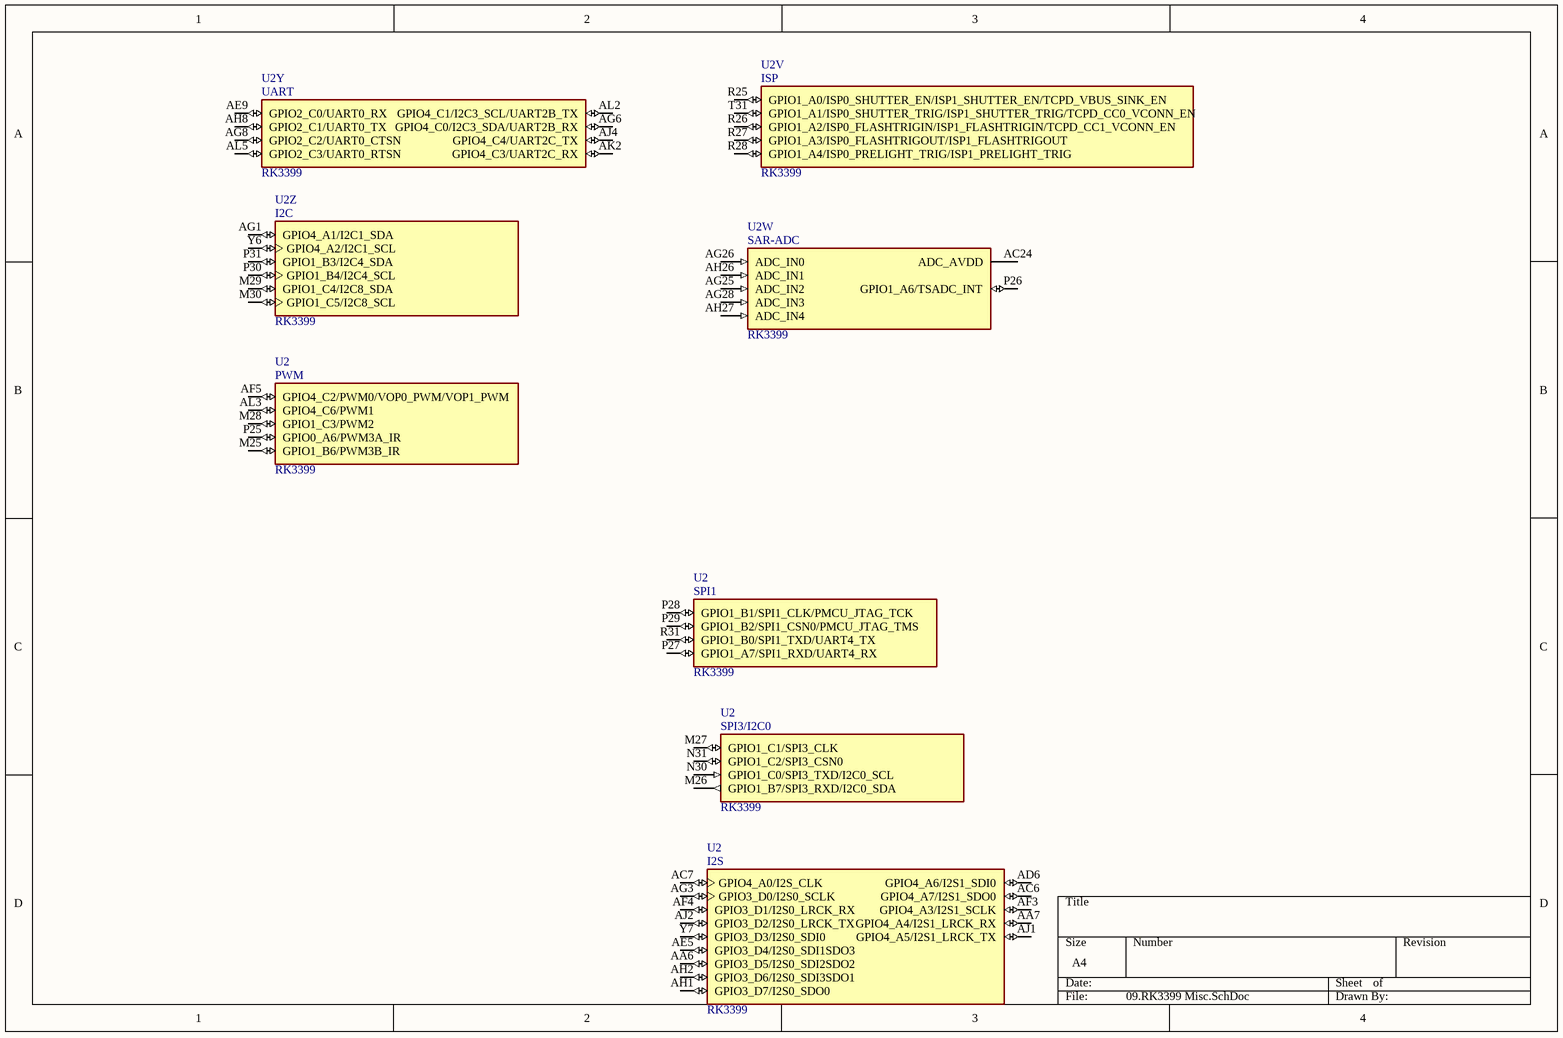
[diagram p7: 09.RK3399 Misc.SchDoc]

### Parts
U2  RK3399  [BGA828C65P31X31_2100X2100X161N]  (parts V,W,Y,Z,27,30,31,32 of 32)

### Nets

Not connected (* = marked no-connect by the designer): U2 AA6(GPIO3_D5/I2S0_SDI2SDO2) AA7(GPIO4_A4/I2S1_LRCK_RX) AC6(GPIO4_A7/I2S1_SDO0) AC7(GPIO4_A0/I2S_CLK) AC24(ADC_AVDD) AD6(GPIO4_A6/I2S1_SDI0) AE5(GPIO3_D4/I2S0_SDI1SDO3) AE9(GPIO2_C0/UART0_RX) AF3(GPIO4_A3/I2S1_SCLK) AF4(GPIO3_D1/I2S0_LRCK_RX) AF5(GPIO4_C2/PWM0/VOP0_PWM/VOP1_PWM) AG1(GPIO4_A1/I2C1_SDA) AG3(GPIO3_D0/I2S0_SCLK) AG6(GPIO4_C0/I2C3_SDA/UART2B_RX) AG8(GPIO2_C2/UART0_CTSN) AG25(ADC_IN2) AG26(ADC_IN0) AG28(ADC_IN3) AH1(GPIO3_D7/I2S0_SDO0) AH2(GPIO3_D6/I2S0_SDI3SDO1) AH8(GPIO2_C1/UART0_TX) AH26(ADC_IN1) AH27(ADC_IN4) AJ1(GPIO4_A5/I2S1_LRCK_TX) AJ2(GPIO3_D2/I2S0_LRCK_TX) AJ4(GPIO4_C4/UART2C_TX) AK2(GPIO4_C3/UART2C_RX) AL2(GPIO4_C1/I2C3_SCL/UART2B_TX) AL3(GPIO4_C6/PWM1) AL5(GPIO2_C3/UART0_RTSN) M25(GPIO1_B6/PWM3B_IR) M26(GPIO1_B7/SPI3_RXD/I2C0_SDA) M27(GPIO1_C1/SPI3_CLK) M28(GPIO1_C3/PWM2) M29(GPIO1_C4/I2C8_SDA) M30(GPIO1_C5/I2C8_SCL) N30(GPIO1_C0/SPI3_TXD/I2C0_SCL) N31(GPIO1_C2/SPI3_CSN0) P25(GPIO0_A6/PWM3A_IR) P26(GPIO1_A6/TSADC_INT) P27(GPIO1_A7/SPI1_RXD/UART4_RX) P28(GPIO1_B1/SPI1_CLK/PMCU_JTAG_TCK) P29(GPIO1_B2/SPI1_CSN0/PMCU_JTAG_TMS) P30(GPIO1_B4/I2C4_SCL) P31(GPIO1_B3/I2C4_SDA) R25(GPIO1_A0/ISP0_SHUTTER_EN/ISP1_SHUTTER_EN/TCPD_VBUS_SINK_EN) R26(GPIO1_A2/ISP0_FLASHTRIGIN/ISP1_FLASHTRIGIN/TCPD_CC1_VCONN_EN) R27(GPIO1_A3/ISP0_FLASHTRIGOUT/ISP1_FLASHTRIGOUT) R28(GPIO1_A4/ISP0_PRELIGHT_TRIG/ISP1_PRELIGHT_TRIG) R31(GPIO1_B0/SPI1_TXD/UART4_TX) T31(GPIO1_A1/ISP0_SHUTTER_TRIG/ISP1_SHUTTER_TRIG/TCPD_CC0_VCONN_EN) Y6(GPIO4_A2/I2C1_SCL) Y7(GPIO3_D3/I2S0_SDI0)

### Notes on the sheet
- (in symbol RK3399, part V) ISP
- (in symbol RK3399, part W) SAR-ADC
- (in symbol RK3399, part Y) UART
- (in symbol RK3399, part Z) I2C
- (in symbol RK3399, part 27) PWM
- (in symbol RK3399, part 30) SPI1
- (in symbol RK3399, part 31) SPI3/I2C0
- (in symbol RK3399, part 32) I2S

### Library data of the parts
U2 = RK3399: as U2 on sheet 02.PMIC PMU; SnapEDA_Link: https://www.snapeda.com/parts/RK3399/Fuzhou+Rockchip+Electronics+Co/view-part/?ref=snap; Package: Seeed Technology; MP: RK3399; Check_prices: https://www.snapeda.com/parts/RK3399/Fuzhou+Rockchip+Electronics+Co/view-part/?ref=eda; Price: None; Value: *; Availability: Not in stock

## Sheet 10.LPDDR4.SchDoc
size A3; SheetNumber: 10; SheetTotal: 10
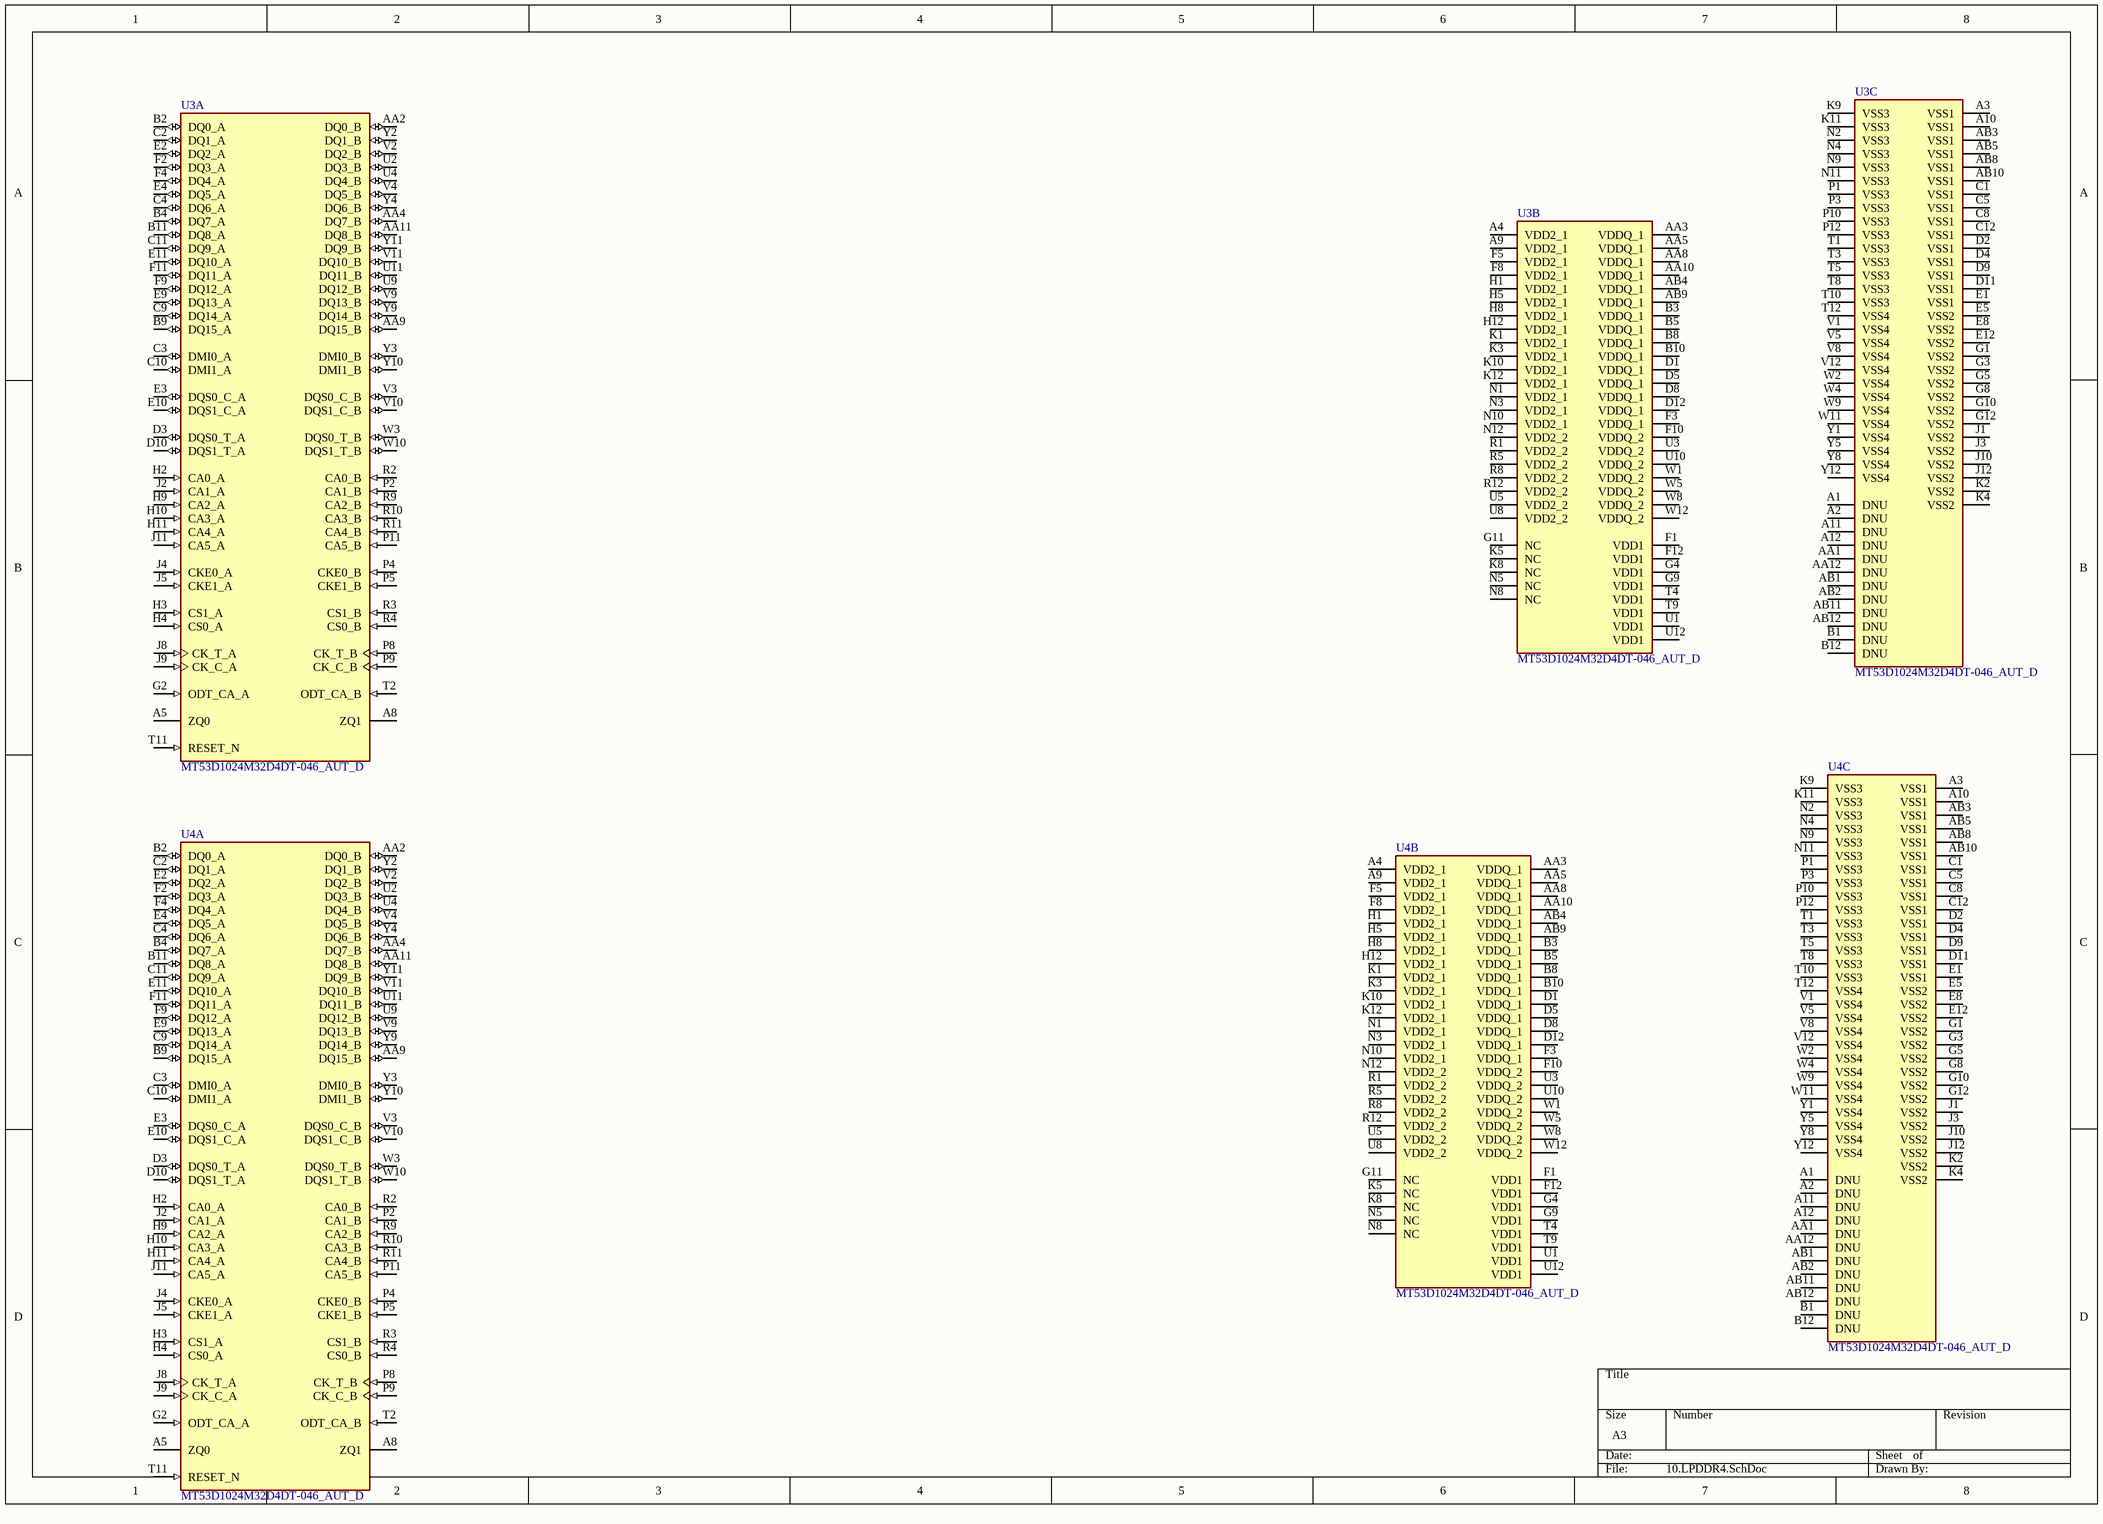
[diagram p8: 10.LPDDR4.SchDoc]

### Parts
U3  MT53D1024M32D4DT-046_AUT_D  [IC_MT53D1024M32D4DT-046_AUT_D]  (parts A,B,C of 3)
U4  MT53D1024M32D4DT-046_AUT_D  [IC_MT53D1024M32D4DT-046_AUT_D]  (parts A,B,C of 3)

### Nets

Not connected (* = marked no-connect by the designer): U3 A1(DNU) A2(DNU) A3(VSS1) A4(VDD2_1) A5(ZQ0) A8(ZQ1) A9(VDD2_1) A10(VSS1) A11(DNU) A12(DNU) AA1(DNU) AA2(DQ0_B) AA3(VDDQ_1) AA4(DQ7_B) AA5(VDDQ_1) AA8(VDDQ_1) AA9(DQ15_B) AA10(VDDQ_1) AA11(DQ8_B) AA12(DNU) AB1(DNU) AB2(DNU) AB3(VSS1) AB4(VDDQ_1) AB5(VSS1) AB8(VSS1) AB9(VDDQ_1) AB10(VSS1) AB11(DNU) AB12(DNU) B1(DNU) B2(DQ0_A) B3(VDDQ_1) B4(DQ7_A) B5(VDDQ_1) B8(VDDQ_1) B9(DQ15_A) B10(VDDQ_1) B11(DQ8_A) B12(DNU) C1(VSS1) C2(DQ1_A) C3(DMI0_A) C4(DQ6_A) C5(VSS1) C8(VSS1) C9(DQ14_A) C10(DMI1_A) C11(DQ9_A) C12(VSS1) D1(VDDQ_1) D2(VSS1) D3(DQS0_T_A) D4(VSS1) D5(VDDQ_1) D8(VDDQ_1) D9(VSS1) D10(DQS1_T_A) D11(VSS1) D12(VDDQ_1) E1(VSS1) E2(DQ2_A) E3(DQS0_C_A) E4(DQ5_A) E5(VSS2) E8(VSS2) E9(DQ13_A) E10(DQS1_C_A) E11(DQ10_A) E12(VSS2) F1(VDD1) F2(DQ3_A) F3(VDDQ_1) F4(DQ4_A) F5(VDD2_1) F8(VDD2_1) F9(DQ12_A) F10(VDDQ_2) F11(DQ11_A) F12(VDD1) G1(VSS2) G2(ODT_CA_A) G3(VSS2) G4(VDD1) G5(VSS2) G8(VSS2) G9(VDD1) G10(VSS2) G11(NC) G12(VSS2) H1(VDD2_1) H2(CA0_A) H3(CS1_A) H4(CS0_A) H5(VDD2_1) H8(VDD2_1) H9(CA2_A) H10(CA3_A) H11(CA4_A) H12(VDD2_1) J1(VSS2) J2(CA1_A) J3(VSS2) J4(CKE0_A) J5(CKE1_A) J8(CK_T_A) J9(CK_C_A) J10(VSS2) J11(CA5_A) J12(VSS2) K1(VDD2_1) K2(VSS2) K3(VDD2_1) K4(VSS2) K5(NC) K8(NC) K9(VSS3) K10(VDD2_1) K11(VSS3) K12(VDD2_1) N1(VDD2_1) N2(VSS3) N3(VDD2_1) N4(VSS3) N5(NC) N8(NC) N9(VSS3) N10(VDD2_1) N11(VSS3) N12(VDD2_2) P1(VSS3) P2(CA1_B) P3(VSS3) P4(CKE0_B) P5(CKE1_B) P8(CK_T_B) P9(CK_C_B) P10(VSS3) P11(CA5_B) P12(VSS3) R1(VDD2_2) R2(CA0_B) R3(CS1_B) R4(CS0_B) R5(VDD2_2) R8(VDD2_2) R9(CA2_B) R10(CA3_B) R11(CA4_B) R12(VDD2_2) T1(VSS3) T2(ODT_CA_B) T3(VSS3) T4(VDD1) T5(VSS3) T8(VSS3) T9(VDD1) T10(VSS3) T11(RESET_N) T12(VSS4) U1(VDD1) U2(DQ3_B) U3(VDDQ_2) U4(DQ4_B) U5(VDD2_2) U8(VDD2_2) U9(DQ12_B) U10(VDDQ_2) U11(DQ11_B) U12(VDD1) V1(VSS4) V2(DQ2_B) V3(DQS0_C_B) V4(DQ5_B) V5(VSS4) V8(VSS4) V9(DQ13_B) V10(DQS1_C_B) V11(DQ10_B) V12(VSS4) W1(VDDQ_2) W2(VSS4) W3(DQS0_T_B) W4(VSS4) W5(VDDQ_2) W8(VDDQ_2) W9(VSS4) W10(DQS1_T_B) W11(VSS4) W12(VDDQ_2) Y1(VSS4) Y2(DQ1_B) Y3(DMI0_B) Y4(DQ6_B) Y5(VSS4) Y8(VSS4) Y9(DQ14_B) Y10(DMI1_B) Y11(DQ9_B) Y12(VSS4); U4 A1(DNU) A2(DNU) A3(VSS1) A4(VDD2_1) A5(ZQ0) A8(ZQ1) A9(VDD2_1) A10(VSS1) A11(DNU) A12(DNU) AA1(DNU) AA2(DQ0_B) AA3(VDDQ_1) AA4(DQ7_B) AA5(VDDQ_1) AA8(VDDQ_1) AA9(DQ15_B) AA10(VDDQ_1) AA11(DQ8_B) AA12(DNU) AB1(DNU) AB2(DNU) AB3(VSS1) AB4(VDDQ_1) AB5(VSS1) AB8(VSS1) AB9(VDDQ_1) AB10(VSS1) AB11(DNU) AB12(DNU) B1(DNU) B2(DQ0_A) B3(VDDQ_1) B4(DQ7_A) B5(VDDQ_1) B8(VDDQ_1) B9(DQ15_A) B10(VDDQ_1) B11(DQ8_A) B12(DNU) C1(VSS1) C2(DQ1_A) C3(DMI0_A) C4(DQ6_A) C5(VSS1) C8(VSS1) C9(DQ14_A) C10(DMI1_A) C11(DQ9_A) C12(VSS1) D1(VDDQ_1) D2(VSS1) D3(DQS0_T_A) D4(VSS1) D5(VDDQ_1) D8(VDDQ_1) D9(VSS1) D10(DQS1_T_A) D11(VSS1) D12(VDDQ_1) E1(VSS1) E2(DQ2_A) E3(DQS0_C_A) E4(DQ5_A) E5(VSS2) E8(VSS2) E9(DQ13_A) E10(DQS1_C_A) E11(DQ10_A) E12(VSS2) F1(VDD1) F2(DQ3_A) F3(VDDQ_1) F4(DQ4_A) F5(VDD2_1) F8(VDD2_1) F9(DQ12_A) F10(VDDQ_2) F11(DQ11_A) F12(VDD1) G1(VSS2) G2(ODT_CA_A) G3(VSS2) G4(VDD1) G5(VSS2) G8(VSS2) G9(VDD1) G10(VSS2) G11(NC) G12(VSS2) H1(VDD2_1) H2(CA0_A) H3(CS1_A) H4(CS0_A) H5(VDD2_1) H8(VDD2_1) H9(CA2_A) H10(CA3_A) H11(CA4_A) H12(VDD2_1) J1(VSS2) J2(CA1_A) J3(VSS2) J4(CKE0_A) J5(CKE1_A) J8(CK_T_A) J9(CK_C_A) J10(VSS2) J11(CA5_A) J12(VSS2) K1(VDD2_1) K2(VSS2) K3(VDD2_1) K4(VSS2) K5(NC) K8(NC) K9(VSS3) K10(VDD2_1) K11(VSS3) K12(VDD2_1) N1(VDD2_1) N2(VSS3) N3(VDD2_1) N4(VSS3) N5(NC) N8(NC) N9(VSS3) N10(VDD2_1) N11(VSS3) N12(VDD2_2) P1(VSS3) P2(CA1_B) P3(VSS3) P4(CKE0_B) P5(CKE1_B) P8(CK_T_B) P9(CK_C_B) P10(VSS3) P11(CA5_B) P12(VSS3) R1(VDD2_2) R2(CA0_B) R3(CS1_B) R4(CS0_B) R5(VDD2_2) R8(VDD2_2) R9(CA2_B) R10(CA3_B) R11(CA4_B) R12(VDD2_2) T1(VSS3) T2(ODT_CA_B) T3(VSS3) T4(VDD1) T5(VSS3) T8(VSS3) T9(VDD1) T10(VSS3) T11(RESET_N) T12(VSS4) U1(VDD1) U2(DQ3_B) U3(VDDQ_2) U4(DQ4_B) U5(VDD2_2) U8(VDD2_2) U9(DQ12_B) U10(VDDQ_2) U11(DQ11_B) U12(VDD1) V1(VSS4) V2(DQ2_B) V3(DQS0_C_B) V4(DQ5_B) V5(VSS4) V8(VSS4) V9(DQ13_B) V10(DQS1_C_B) V11(DQ10_B) V12(VSS4) W1(VDDQ_2) W2(VSS4) W3(DQS0_T_B) W4(VSS4) W5(VDDQ_2) W8(VDDQ_2) W9(VSS4) W10(DQS1_T_B) W11(VSS4) W12(VDDQ_2) Y1(VSS4) Y2(DQ1_B) Y3(DMI0_B) Y4(DQ6_B) Y5(VSS4) Y8(VSS4) Y9(DQ14_B) Y10(DMI1_B) Y11(DQ9_B) Y12(VSS4)

### Library data of the parts
U3 U4 = MT53D1024M32D4DT-046_AUT_D: Package: None; Value: *; MP: MT53D1024M32D4DT-046_AUT_D; Availability: Unavailable; Price: None

## Nets that join several sheets
GND: 02.PMIC PMU (13 pins), 03.RK3399 Power (240 pins)